# Altium schematic sheet STM32_Board_with_IMU.SchDoc
size A3; SheetNumber: 1; SheetTotal: 2
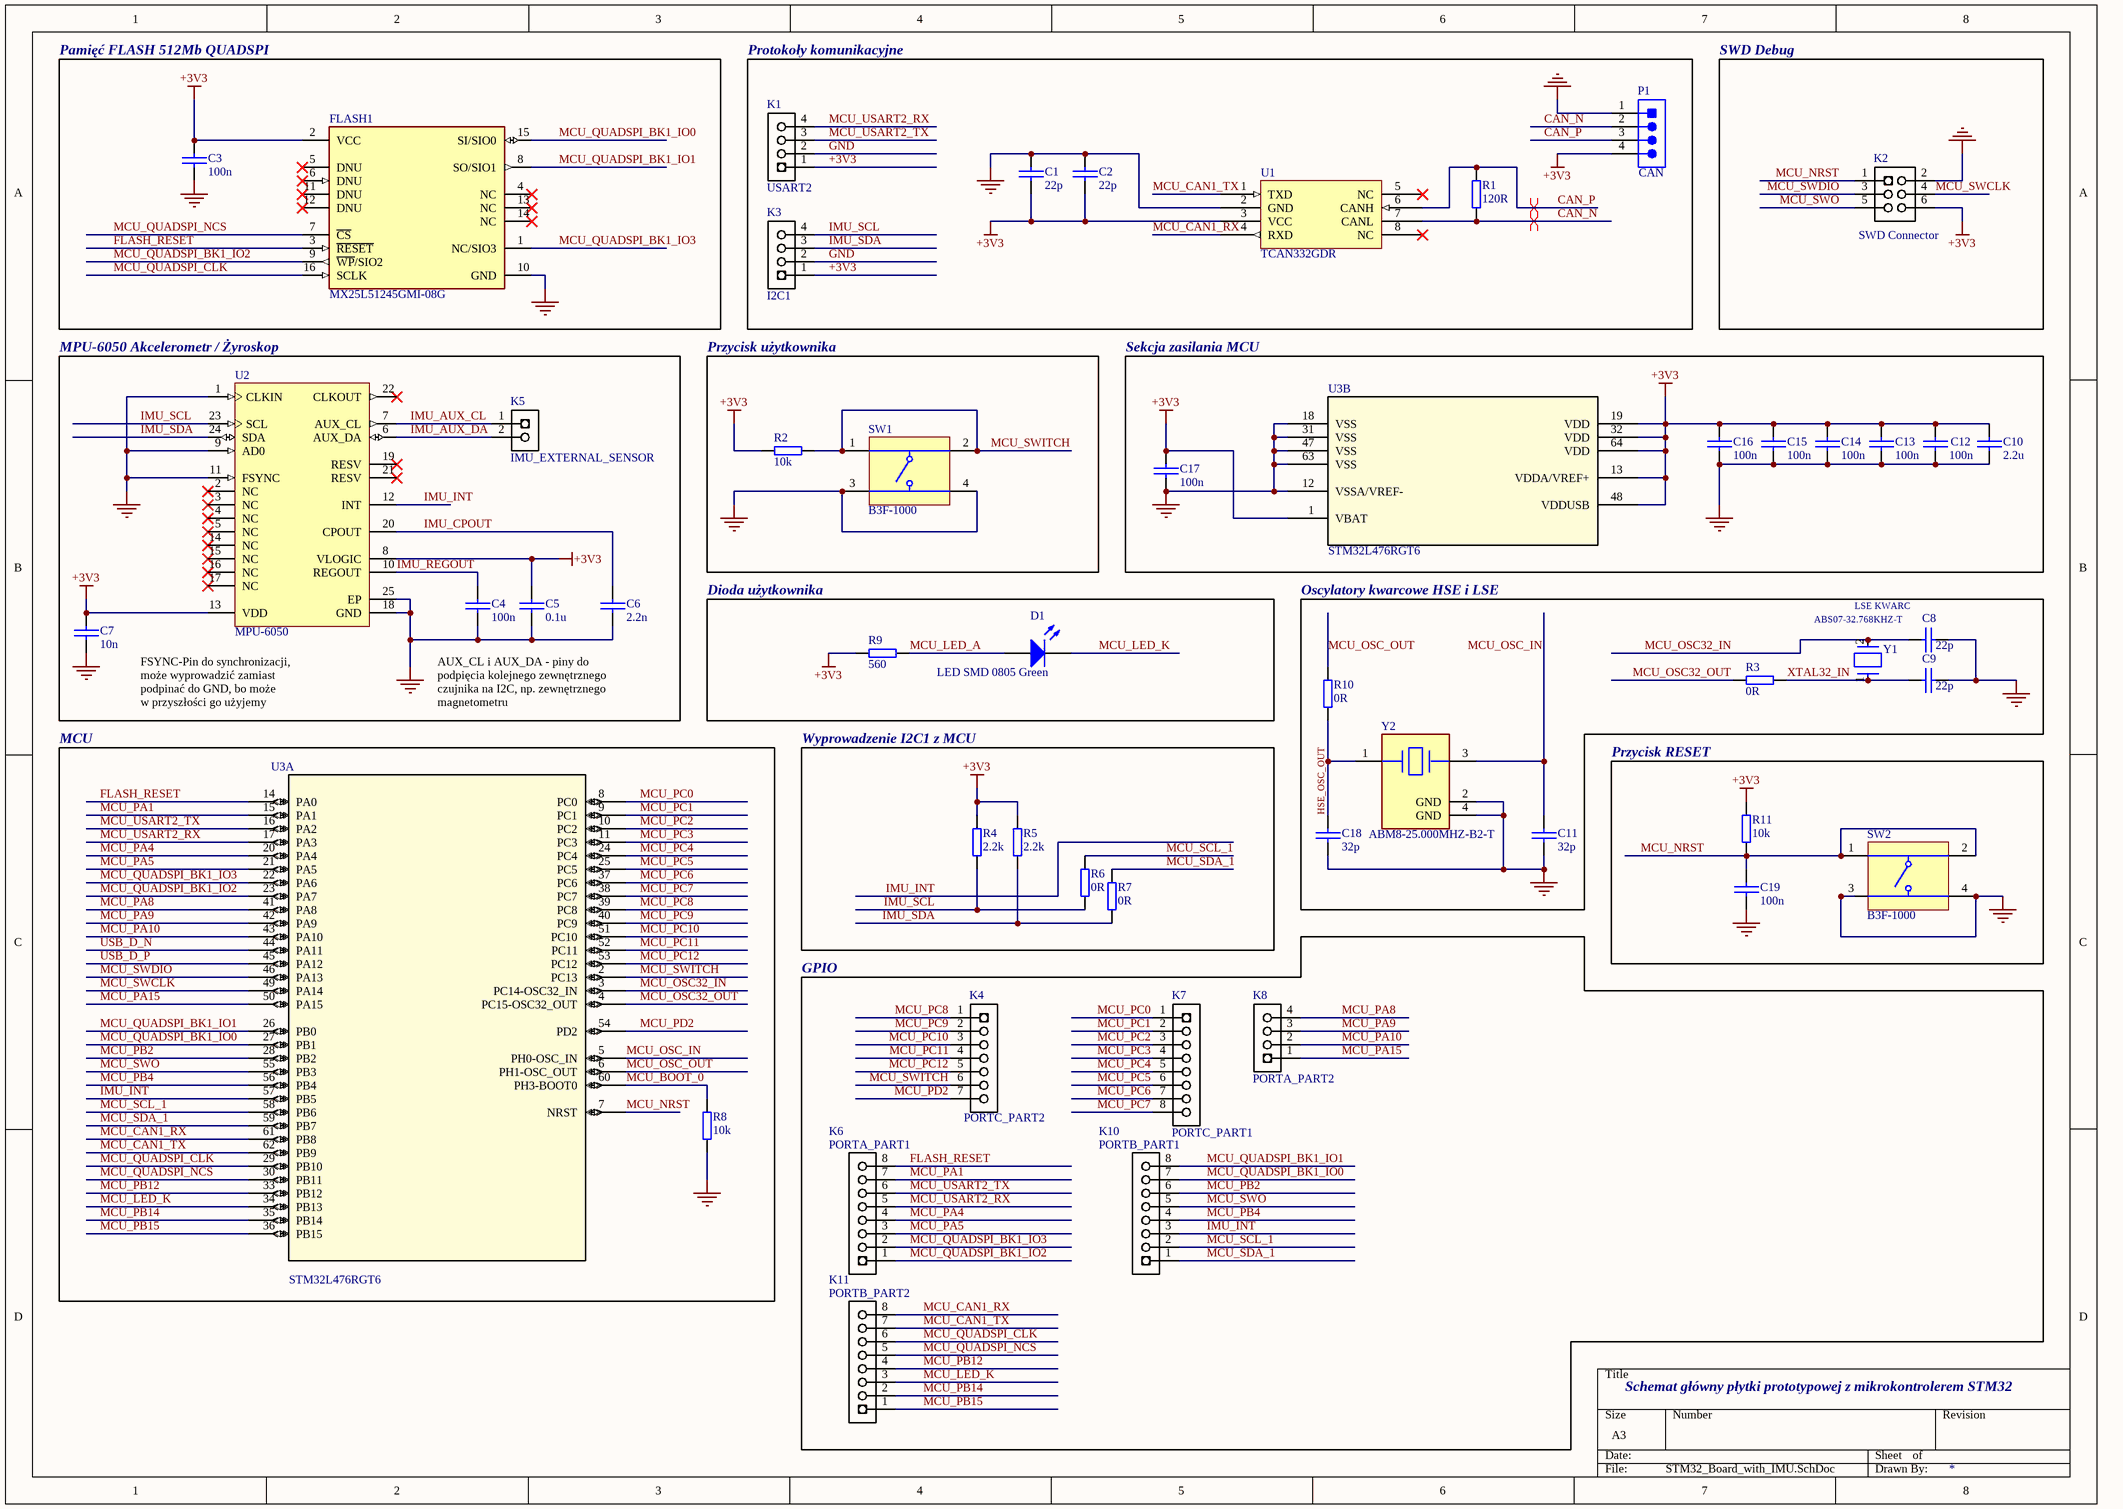
[diagram p0: STM32_Board_with_IMU.SchDoc]

## Parts
C1  22p  [0805]
C2  22p  [0805]
C3  100n  [0805]
C4  100n  [0805]
C5  0.1u  [0805]
C6  2.2n  [0805]
C7  10n  [0805]
C8  22p  [0805]
C9  22p  [0805]
C10  2.2u  [0805]
C11  32p  [0805]
C12  100n  [0805]
C13  100n  [0805]
C14  100n  [0805]
C15  100n  [0805]
C16  100n  [0805]
C17  100n  [0805]
C18  32p  [0805]
C19  100n  [0805]
D1  LED SMD 0805 Green  [0805_PAD]
FLASH1  MX25L51245GMI-08G  [FP-MX25L51245GMI-08G-IPC_C]
K1  USART2  [HEADER-1X4]
K2  SWD Connector  [HEADER-2X3]
K3  I2C1  [HEADER-1X4]
K4  PORTC_PART2  [HEADER-1X7]
K5  IMU_EXTERNAL_SENSOR  [HEADER-1X2]
K6  PORTA_PART1  [HEADER-1X8]
K7  PORTC_PART1  [HEADER-1X8]
K8  PORTA_PART2  [HEADER-1X4]
K10  PORTB_PART1  [HEADER-1X8]
K11  PORTB_PART2  [HEADER-1X8]
P1  CAN  [TECO-640456-4]
R1  120R  [0805]
R2  10k  [0805]
R3  0R  [0805]
R4  2.2k  [0805]
R5  2.2k  [0805]
R6  0R  [0805]
R7  0R  [0805]
R8  10k  [0805]
R9  560  [0805]
R10  0R  [0805]
R11  10k  [0805]
SW1  B3F-1000  [OMRON-B3F-1000-4_V]
SW2  B3F-1000  [OMRON-B3F-1000-4_V]
U1  TCAN332GDR  [SOIC-8_x1]
U2  MPU-6050  [IS-QFN-24_V]
U3  STM32L476RGT6  [LQFP64-10x10mm_STM]  (parts A,B of 2)
Y1  ABS07-32.768KHZ-T  [FP-ABS07-MFG]
Y2  ABM8-25.000MHZ-B2-T  [FP-ABM8-MFG]

## Blocks framed on the sheet
Pamięć FLASH 512Mb QUADSPI: C3 FLASH1
Protokoły komunikacyjne: C1 C2 K1 K3 P1 R1 U1
SWD Debug: K2
MPU-6050 Akcelerometr / Żyroskop: C4-C7 K5 U2
Przycisk użytkownika: R2 SW1
Sekcja zasilania MCU: C10 C12-C17 U3
Dioda użytkownika: D1 R9
Oscylatory kwarcowe HSE i LSE: C8 C9 C11 C18 R3 R10 Y1 Y2
MCU: R8 U3
Wyprowadzenie I2C1 z MCU: R4-R7
Przycisk RESET: C19 R11 SW2

## Nets
+3V3: C1.2 C2.2 C3.1 C5.1 C7.1 C10.2 C12.2 C13.2 C14.2 C15.2 C16.2 C17.1 FLASH1.2(VCC) K1.1 K2.6 K3.1 P1.4 R2.1 R4.2 R5.2 R9.1 R11.1 U1.3(VCC) U2.8(VLOGIC) U2.13(VDD) U3.1(VBAT) U3.13(VDDA/VREF+) U3.19(VDD) U3.32(VDD) U3.48(VDDUSB) U3.64(VDD)
GND: C1.1 C2.1 C3.2 C4.2 C5.2 C6.2 C7.2 C8.1 C9.1 C10.1 C11.1 C12.1 C13.1 C14.1 C15.1 C16.1 C17.2 C18.2 C19.1 FLASH1.10(GND) K1.2 K2.2 K3.2 P1.1 R8.2 SW1.3 SW1.4 SW2.3 SW2.4 U1.2(GND) U2.1(CLKIN) U2.9(AD0) U2.11(FSYNC) U2.18(GND) U2.25(EP) U3.12(VSSA/VREF-) U3.18(VSS) U3.31(VSS) U3.47(VSS) U3.63(VSS) Y2.2(GND) Y2.4(GND)
CAN_N: P1.2 R1.1 U1.7(CANL)
CAN_P: P1.3 R1.2 U1.6(CANH)
FLASH_RESET: FLASH1.3(~{RESET}) K6.8 U3.14(PA0)
HSE_OSC_OUT: C18.1 R10.1 Y2.1
IMU_AUX_CL: K5.1 U2.7(AUX_CL)
IMU_AUX_DA: K5.2 U2.6(AUX_DA)
IMU_CPOUT: C6.1 U2.20(CPOUT)
IMU_INT: K10.3 U2.12(INT) U3.57(PB5)
IMU_REGOUT: C4.1 U2.10(REGOUT)
IMU_SCL: K3.4 R4.1 R6.1 U2.23(SCL)
IMU_SDA: K3.3 R5.1 R7.1 U2.24(SDA)
MCU_BOOT_0: R8.1 U3.60(PH3-BOOT0)
MCU_CAN1_RX: K11.8 U1.4(RXD) U3.61(PB8)
MCU_CAN1_TX: K11.7 U1.1(TXD) U3.62(PB9)
MCU_LED_A: D1.2(A) R9.2
MCU_LED_K: D1.1(K) K11.3 U3.34(PB13)
MCU_NRST: C19.2 K2.1 R11.2 SW2.1 SW2.2 U3.7(NRST)
MCU_OSC32_IN: C8.2 U3.3(PC14-OSC32_IN) Y1.2
MCU_OSC32_OUT: R3.1 U3.4(PC15-OSC32_OUT)
MCU_OSC_IN: C11.2 U3.5(PH0-OSC_IN) Y2.3
MCU_OSC_OUT: R10.2 U3.6(PH1-OSC_OUT)
MCU_PA1: K6.7 U3.15(PA1)
MCU_PA4: K6.4 U3.20(PA4)
MCU_PA5: K6.3 U3.21(PA5)
MCU_PA8: K8.4 U3.41(PA8)
MCU_PA9: K8.3 U3.42(PA9)
MCU_PA10: K8.2 U3.43(PA10)
MCU_PA15: K8.1 U3.50(PA15)
MCU_PB2: K10.6 U3.28(PB2)
MCU_PB4: K10.4 U3.56(PB4)
MCU_PB12: K11.4 U3.33(PB12)
MCU_PB14: K11.2 U3.35(PB14)
MCU_PB15: K11.1 U3.36(PB15)
MCU_PC0: K7.1 U3.8(PC0)
MCU_PC1: K7.2 U3.9(PC1)
MCU_PC2: K7.3 U3.10(PC2)
MCU_PC3: K7.4 U3.11(PC3)
MCU_PC4: K7.5 U3.24(PC4)
MCU_PC5: K7.6 U3.25(PC5)
MCU_PC6: K7.7 U3.37(PC6)
MCU_PC7: K7.8 U3.38(PC7)
MCU_PC8: K4.1 U3.39(PC8)
MCU_PC9: K4.2 U3.40(PC9)
MCU_PC10: K4.3 U3.51(PC10)
MCU_PC11: K4.4 U3.52(PC11)
MCU_PC12: K4.5 U3.53(PC12)
MCU_PD2: K4.7 U3.54(PD2)
MCU_QUADSPI_BK1_IO0: FLASH1.15(SI/SIO0) K10.7 U3.27(PB1)
MCU_QUADSPI_BK1_IO1: FLASH1.8(SO/SIO1) K10.8 U3.26(PB0)
MCU_QUADSPI_BK1_IO2: FLASH1.9(~{WP}/SIO2) K6.1 U3.23(PA7)
MCU_QUADSPI_BK1_IO3: FLASH1.1(NC/SIO3) K6.2 U3.22(PA6)
MCU_QUADSPI_CLK: FLASH1.16(SCLK) K11.6 U3.29(PB10)
MCU_QUADSPI_NCS: FLASH1.7(~{CS}) K11.5 U3.30(PB11)
MCU_SCL_1: K10.2 R6.2 U3.58(PB6)
MCU_SDA_1: K10.1 R7.2 U3.59(PB7)
MCU_SWCLK: K2.4 U3.49(PA14)
MCU_SWDIO: K2.3 U3.46(PA13)
MCU_SWITCH: K4.6 R2.2 SW1.1 SW1.2 U3.2(PC13)
MCU_SWO: K2.5 K10.5 U3.55(PB3)
MCU_USART2_RX: K1.4 K6.5 U3.17(PA3)
MCU_USART2_TX: K1.3 K6.6 U3.16(PA2)
USB_D_N: U3.44(PA11)
USB_D_P: U3.45(PA12)
XTAL32_IN: C9.2 R3.2 Y1.1

Not connected (* = marked no-connect by the designer): FLASH1 4(NC)* 5(DNU)* 6(DNU)* 11(DNU)* 12(DNU)* 13(NC)* 14(NC)*; U1 5(NC)* 8(NC)*; U2 2(NC)* 3(NC)* 4(NC)* 5(NC)* 14(NC)* 15(NC)* 16(NC)* 17(NC)* 19(RESV)* 21(RESV)* 22(CLKOUT)*

## Layout directives
differential pair: CAN_N, CAN_P

## Notes on the sheet
- LSE KWARC
- FSYNC-Pin do synchronizacji, może wyprowadzić zamiast podpinać do GND, bo może
  w przyszłości go użyjemy
- AUX_CL i AUX_DA - piny do podpięcia kolejnego zewnętrznego czujnika na I2C, np. zewnętrznego magnetometru
- GPIO
- Schemat główny płytki prototypowej z mikrokontrolerem STM32

## Library data of the parts
C1-C19 = Kondensator
D1 = LED SMD 0805 Green: WURTH ELEKTRONIK - 150080GS75000 - LED, Green, SMD, 0805, 30 mA, 3.2 V, 520 nm; Manufacturer: Wurth Electronics; Lens Color: Colorless; Viewing Angle: 140°; Lens Style: Clear,Flat,Rectangular; Luminous Intensity: 450mcd; Forward Voltage: 3.2V; Wavelength: 520nm; Forward Current: 30mA; Test Current: 20mA; Lens Transparency: Clear; Lens Size: 1.25mm; Supplier 1: Rs; Manufacturer Part Number: 150080GS75000; RoHS: Yes; Category: LEDs; Stock 1: 31800; Mounting Technology: Surface Mount; Case/Package: 0805; Color: Green; Case Code (Metric): 2012; Case Code (Imperial): 0805; Min Operating Temperature: -40°C; Max Operating Temperature: 85°C; Packaging: Cut Tape; Dominant Wavelength: 520nm; Series: WL-SMCW; Package Quantity: 1; Length: 2mm; Width: 1.25mm; Height: 0.8mm; RoHS Compliant: Yes; Reach SVHC Compliant: Unknown; ComponentLink1URL: https://datasheet.ciiva.com/29563/150080gs75000-29563008.pdf?src-supplier=Digi-Key; ComponentLink1Description: https://datasheet.ciiva.com/29563/150080gs75000-29563008.pdf?src-supplier=Digi-Key; ComponentLink2URL: https://datasheet.ciiva.com/29279/759434-da-01-en-chipled-0805-w-kl-gruen-150080gs75000-29279039.pdf?src-supplier=Conrad; ComponentLink2Description: https://datasheet.ciiva.com/29279/759434-da-01-en-chipled-0805-w-kl-gruen-150080gs75000-29279039.pdf?src-supplier=Conrad
FLASH1 = CMP-105207-000008-1: IC FLASH 512MBIT SPI/QUAD 16SOP; RoHS Compliant: Yes
K1 K3 K8 = HEADER-1X4: Supplier 1: Digi-Key; Supplier Part Number 1: S1011E-36-ND
K2 = HEADER-2X3
K4 = HEADER-1X7: Supplier 1: Digi-Key; Supplier Part Number 1: S1011E-36-ND
K5 = HEADER-1X2: REEL: TH; Supplier 1: Digi-Key; Supplier Part Number 1: S1011E-36-ND
K6 K7 K10 K11 = HEADER-1X8: Supplier 1: Digi-Key; Supplier Part Number 1: S1011E-36-ND
P1 = CMP-2000-05419-1: Male Header, Pitch 2.54 mm, 1 x 4 Position, Height 10.03 mm, Tail Length 3.56 mm, RoHS, Bulk; Manufacturer: TE Connectivity; Material, Housing: Polyester; Primary Type: InterconnectSystem; Mount Angle: Vertical; Color, Housing: White; Current, Rating: 5 / A; Agency Approvals: CSA,UL; Contact Termination Area Plating: Tin; Temperature, Operating: -55to+105 / degC; Standards: RoHSCompliant,ELVCompliant,UL94V-0; Number of Positions: 4; Brand/Series: MTA-100Series; Angle: Straight; Pin Spacing: 0.1 / "; Material, Contact: CopperAlloy; Connector Type: MTA-100; Special Features: Pinstrip; Mounting Hole Size: 0.04 / "; Contact Centerline Spacing: 0.100 / in.; Voltage, Rating: 250 / V; Manufacturer URL: http://www.te.com/; Length, Pin: 0.14 / "; Length, Overall: 0.4 / "; Color: White; Flammability Rating: UL94V-0; Mounting Type: PCMount; Termination: Solder; Datasheet URL: https://datasheet.ciiva.com/16286/eng-ds-82056-mta-0608-16286228.pdf; Number of Contacts: 4; Contact Shape: Square; Contact Mating Area Plating: Tin; Length, Terminal Post: 0.14 / in.; Size, Post: 0.025 / in.; Contact Plating: Tin; Type: PCBPlug; Datasheet Version: Dec-14; Number of Rows: 1
R1-R11 = Rezystor
SW1 SW2 = CMP-1677-00002-1: Tactile Switch, SPST-NO, 0.05 A, 5 to 24 V, -25 to 70 degC, 4-Pin THD, RoHS, Bulk; Shielding: Shielded; Gender: Female; Capacitance: -45 f; Voltage Rating: 150 V; Current Rating: 1.5 A; Radiation Hardening: No; Contact Plating: Gold; Height: 14.99 mm; Min Operating Temperature: -40 degC; Packaging: Tray; ComponentLink2Description: Datasheet; ComponentLink1URL: http://www.omron.com/; Lead Pitch: 1.27 mm; RoHSCompliant: true; Pins: 8; PackageReference: B3F-1000; Width: 25.4 mm; Contact Material: Brass; ComponentLink2URL: http://www.omron.com/ecb/products/pdf/en-b3f.pdf; PackageDescription: 4-Pin Through Hole Device, Body 6 x 6 mm; DatasheetVersion: Jan-15; ComponentLink1Description: Manufacturer URL; Package Quantity: 1080; Mount: Through Hole; Length: 18.34 mm; Max Operating Temperature: 70 degC
U1 = TCAN332GDR: Can Transceiver
U2 = CMP-1753-00002-2: 3-Axis Gyroscope, Accelerometer and a Digital Motion Processor(TM) (DMP), 2.375 to 3.46 V, -40 to 85 degC, 24-Pin QFN, RoHS, Tape and Reel; Manufacturer: InvenSense; Featured Product: MPU-60506-Axis,IntegratedI²CSolution; Other Names: 1428-1007-2 / MPU6050; Sensor Type: MotionTracking; Online Catalog: MPU-6000™Series; Unit PriceUSD: Digital; Datasheet Version: Rev. 3.3, 05/2012; Category: Sensors,Transducers; Datasheet URL: http://datasheet.octopart.com/MPU-6050-InvenSense-datasheet-14421344.pdf; Family: Multifunction; Standard Package: 5,000; Manufacturer URL: http://www.invensense.com/; Output Type: Digital; Dynamic Catalog: MPU-6000™Series
U3 = STM32L476RGT6: No Description Available; Mfr_Name: STMicroelectronics; RefDes: RefDes; Type: Type
Y1 = CMP-0447-00001-4: Crystal 32.768kHz ±20ppm (Tol) 12.5pF FUND 70kΩ 2-Pin CSMD T/R; ESR (Equivalent Series Resistance): 70kR; Radiation Hardening: No; Frequency: 32.768kHz; Length: 3.2mm; Max Operating Temperature: 85°C; Number of Pins: 2; Series: ABS07; Min Operating Temperature: -40°C; Frequency Tolerance: 20ppm; Packaging: Tape and Reel; Height: 0.9mm; Width: 1.5mm; Depth: 1.5mm; Load Capacitance: 12.5pF; RoHS Compliant: Yes; Tolerance: 20ppm; Termination: SMD/SMT; Lead Free: Lead Free; Series Resistance: 70kR; REACH SVHC: No SVHC; Case/Package: CSMD; Operating Frequency: 32.768 kHz; Package Quantity: 3000
Y2 = CMP-27762-013668-1: Crystal 25MHz ±20ppm 18pF SMD-4 3.2mm x 2.5mm; ESR (Equivalent Series Resistance): 50R; Frequency Stability: 50ppm; Max Operating Temperature: 70°C; Operating Frequency: 25 MHz; Mount: Surface Mount; Case/Package: CSMD; Termination: SMD/SMT; Frequency: 25MHz; Frequency Tolerance: 20ppm; Load Capacitance: 18pF; Height: 0.031inch; Lead Free: Lead Free; Min Operating Temperature: -20°C; Depth: 2.5mm; Length: 3.2mm; Resistor Type: Ceramic; Series Resistance: 50R; Radiation Hardening: No; Series: ABM8; Width: 0.098inch; Number of Pins: 4; Package Quantity: 1000; Tolerance: 20ppm; Packaging: Tape and Reel; REACH SVHC: No SVHC